# EAGLE design TIVA_SHIELD_Ver_1.4 (EAGLE 9.6.2)
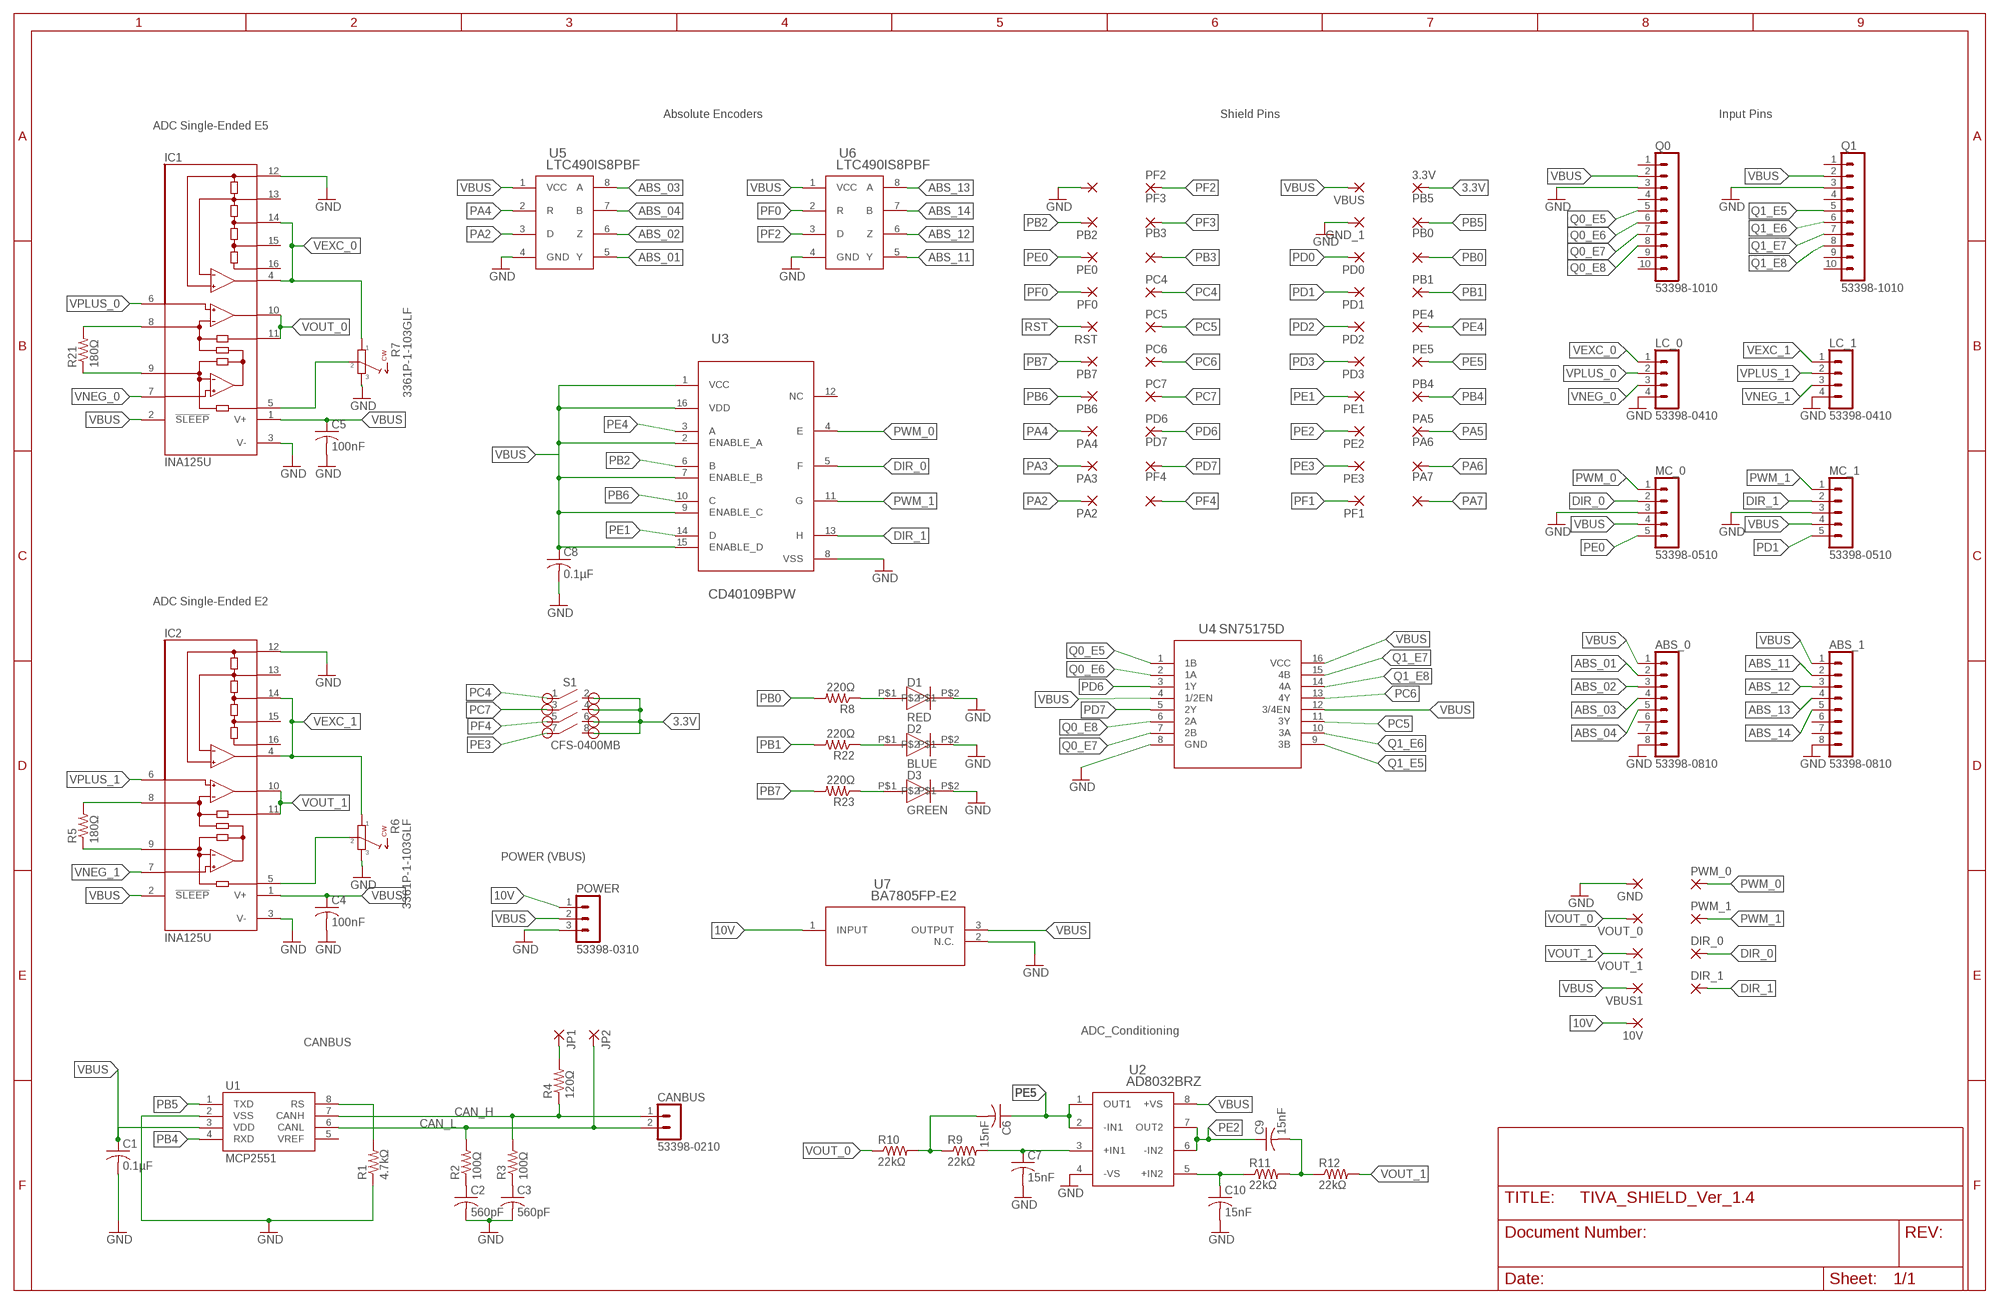
[diagram p0: schematic, sheet 1]

## Parts
3.3V  1,6/0,9  [1,6/0,9]
10V  SMD2  [SMD1,27-2,54]
ABS_0  53398-0810  [53398-0810]
ABS_1  53398-0810  [53398-0810]
C1  0.1µF  C-USC0805  [C0805]
C2  560pF  C-USC0805  [C0805]
C3  560pF  C-USC0805  [C0805]
C4  100nF  C-USC0805  [C0805]
C5  100nF  C-USC0805  [C0805]
C6  15nF  C-USC0805  [C0805]
C7  15nF  C-USC0805  [C0805]
C8  0.1µF  C-USC0805  [C0805]
C9  15nF  C-USC0805  [C0805]
C10  15nF  C-USC0805  [C0805]
CANBUS  53398-0210  [53398-0210]
D1  RED  CHANZON-1206-LED-DIODESMD  [CHANZON-1206-LED-DIODE]
D2  BLUE  CHANZON-1206-LED-DIODESMD  [CHANZON-1206-LED-DIODE]
D3  GREEN  CHANZON-1206-LED-DIODESMD  [CHANZON-1206-LED-DIODE]
DIR_0  SMD2  [SMD1,27-2,54]
DIR_1  SMD2  [SMD1,27-2,54]
GND  SMD2  [SMD1,27-2,54]
GND_0  1,6/0,9  [1,6/0,9]
GND_1  1,6/0,9  [1,6/0,9]
IC1  INA125U  [SO16-1]
IC2  INA125U  [SO16-1]
JP1  1,6/0,9  [1,6/0,9]
JP2  1,6/0,9  [1,6/0,9]
LC_0  53398-0410  [53398-0410]
LC_1  53398-0410  [53398-0410]
MC_0  53398-0510  [53398-0510]
MC_1  53398-0510  [53398-0510]
PA2  1,6/0,9  [1,6/0,9]
PA3  1,6/0,9  [1,6/0,9]
PA4  1,6/0,9  [1,6/0,9]
PA5  1,6/0,9  [1,6/0,9]
PA6  1,6/0,9  [1,6/0,9]
PA7  1,6/0,9  [1,6/0,9]
PB0  1,6/0,9  [1,6/0,9]
PB1  1,6/0,9  [1,6/0,9]
PB2  1,6/0,9  [1,6/0,9]
PB3  1,6/0,9  [1,6/0,9]
PB4  1,6/0,9  [1,6/0,9]
PB5  1,6/0,9  [1,6/0,9]
PB6  1,6/0,9  [1,6/0,9]
PB7  1,6/0,9  [1,6/0,9]
PC4  1,6/0,9  [1,6/0,9]
PC5  1,6/0,9  [1,6/0,9]
PC6  1,6/0,9  [1,6/0,9]
PC7  1,6/0,9  [1,6/0,9]
PD0  1,6/0,9  [1,6/0,9]
PD1  1,6/0,9  [1,6/0,9]
PD2  1,6/0,9  [1,6/0,9]
PD3  1,6/0,9  [1,6/0,9]
PD6  1,6/0,9  [1,6/0,9]
PD7  1,6/0,9  [1,6/0,9]
PE0  1,6/0,9  [1,6/0,9]
PE1  1,6/0,9  [1,6/0,9]
PE2  1,6/0,9  [1,6/0,9]
PE3  1,6/0,9  [1,6/0,9]
PE4  1,6/0,9  [1,6/0,9]
PE5  1,6/0,9  [1,6/0,9]
PF0  1,6/0,9  [1,6/0,9]
PF1  1,6/0,9  [1,6/0,9]
PF2  1,6/0,9  [1,6/0,9]
PF3  1,6/0,9  [1,6/0,9]
PF4  1,6/0,9  [1,6/0,9]
POWER  53398-0310  [53398-0310]
PWM_0  SMD2  [SMD1,27-2,54]
PWM_1  SMD2  [SMD1,27-2,54]
Q0  53398-1010  [53398-1010]
Q1  53398-1010  [53398-1010]
R1  4.7kΩ  R-US_R0805  [R0805]
R2  100Ω  R-US_R0805  [R0805]
R3  100Ω  R-US_R0805  [R0805]
R4  120Ω  R-US_R0805  [R0805]
R5  180Ω  R-US_R0805  [R0805]
R6  3361P-1-103GLF  3361P-1-103GLFSMD  [3361P-1-103GLF]
R7  3361P-1-103GLF  3361P-1-103GLFSMD  [3361P-1-103GLF]
R8  220Ω  R-US_R0805  [R0805]
R9  22kΩ  R-US_R0805  [R0805]
R10  22kΩ  R-US_R0805  [R0805]
R11  22kΩ  R-US_R0805  [R0805]
R12  22kΩ  R-US_R0805  [R0805]
R21  180Ω  R-US_R0805  [R0805]
R22  220Ω  R-US_R0805  [R0805]
R23  220Ω  R-US_R0805  [R0805]
RST  1,6/0,9  [1,6/0,9]
S1  CFS-0400MB  CFS-0400MBSMD  [CFS-0400MB]
U1  MCP2551  [SO08]
U2  AD8032BRZ  [R_8_ADI]
U3  CD40109BPW  [PW0016A_N]
U4  SN75175D  [D16]
U5  LTC490IS8PBF  [SO-8_S]
U6  LTC490IS8PBF  [SO-8_S]
U7  BA7805FP-E2  [TO252-3_ROM]
VBUS  1,6/0,9  [1,6/0,9]
VBUS1  SMD2  [SMD1,27-2,54]
VOUT_0  SMD2  [SMD1,27-2,54]
VOUT_1  SMD2  [SMD1,27-2,54]

## Nets
3.3V: 3.3V.1(P) S1.2 S1.4 S1.6 S1.8
10V: 10V.1(P) POWER.1 U7.1(INPUT)
ABS_01: ABS_0.2 U5.5(Y)
ABS_02: ABS_0.3 U5.6(Z)
ABS_03: ABS_0.4 U5.8(A)
ABS_04: ABS_0.5 U5.7(B)
ABS_11: ABS_1.2 U6.5(Y)
ABS_12: ABS_1.3 U6.6(Z)
ABS_13: ABS_1.4 U6.8(A)
ABS_14: ABS_1.5 U6.7(B)
CAN_H: CANBUS.1 R3.2 R4.1 U1.7(CANH)
CAN_L: CANBUS.2 JP2.1(P) R2.2 U1.6(CANL)
DIR_0: DIR_0.1(P) MC_0.2 U3.5(F)
DIR_1: DIR_1.1(P) MC_1.2 U3.13(H)
GND: ABS_0.8 ABS_1.8 C1.2 C2.2 C3.2 C4.2 C5.2 C7.2 C8.2 C10.2 D1.P$2 D2.P$2 D3.P$2 GND.1(P) GND_0.1(P) GND_1.1(P) IC1.3(V-) IC1.12(REFCOM) IC2.3(V-) IC2.12(REFCOM) LC_0.4 LC_1.4 MC_0.3 MC_1.3 POWER.3 Q0.3 Q1.3 R1.1 R6.3 R7.3 U1.2(VSS) U2.4(-VS) U3.8(VSS) U4.8(GND) U5.4(GND) U6.4(GND) U7.2(N.C.)
N$1: R1.2 U1.8(RS)
N$2: D1.P$1 R8.1
N$3: D2.P$1 R22.1
N$4: C2.1 R2.1
N$5: C3.1 R3.1
N$6: JP1.1(P) R4.2
N$7: IC2.9(RG) R5.1
N$8: IC2.8(RG) R5.2
N$9: IC2.5(REF) R6.2
N$10: IC1.9(RG) R21.1
N$11: IC1.8(RG) R21.2
N$12: IC1.5(REF) R7.2
N$13: C10.1 R11.1 U2.5(+IN2)
N$14: C9.2 R11.2 R12.1
N$15: C7.1 R9.2 U2.3(+IN1)
N$18: C6.2 R9.1 R10.2
N$21: D3.P$1 R23.1
PA2: PA2.1(P) U5.3(D)
PA3: PA3.1(P)
PA4: PA4.1(P) U5.2(R)
PA5: PA5.1(P)
PA6: PA6.1(P)
PA7: PA7.1(P)
PB0: PB0.1(P) R8.2
PB1: PB1.1(P) R22.2
PB2: PB2.1(P) U3.6(B)
PB3: PB3.1(P)
PB4: PB4.1(P) U1.4(RXD)
PB5: PB5.1(P) U1.1(TXD)
PB6: PB6.1(P) U3.10(C)
PB7: PB7.1(P) R23.2
PC4: PC4.1(P) S1.1
PC5: PC5.1(P) U4.11(3Y)
PC6: PC6.1(P) U4.13(4Y)
PC7: PC7.1(P) S1.3
PD0: PD0.1(P)
PD1: MC_1.5 PD1.1(P)
PD2: PD2.1(P)
PD3: PD3.1(P)
PD6: PD6.1(P) U4.3(1Y)
PD7: PD7.1(P) U4.5(2Y)
PE0: MC_0.5 PE0.1(P)
PE1: PE1.1(P) U3.14(D)
PE2: C9.1 PE2.1(P) U2.6(-IN2) U2.7(OUT2)
PE3: PE3.1(P) S1.7
PE4: PE4.1(P) U3.3(A)
PE5: C6.1 PE5.1(P) U2.1(OUT1) U2.2(-IN1)
PF0: PF0.1(P) U6.2(R)
PF1: PF1.1(P)
PF2: PF2.1(P) U6.3(D)
PF3: PF3.1(P)
PF4: PF4.1(P) S1.5
PWM_0: MC_0.1 PWM_0.1(P) U3.4(E)
PWM_1: MC_1.1 PWM_1.1(P) U3.11(G)
Q0_E5: Q0.5 U4.1(1B)
Q0_E6: Q0.6 U4.2(1A)
Q0_E7: Q0.7 U4.7(2B)
Q0_E8: Q0.8 U4.6(2A)
Q1_E5: Q1.5 U4.9(3B)
Q1_E6: Q1.6 U4.10(3A)
Q1_E7: Q1.7 U4.15(4B)
Q1_E8: Q1.8 U4.14(4A)
RST: RST.1(P)
VBUS: ABS_0.1 ABS_1.1 C1.1 C4.1 C5.1 C8.1 IC1.1(V+) IC1.2(!SLEEP) IC2.1(V+) IC2.2(!SLEEP) MC_0.4 MC_1.4 POWER.2 Q0.2 Q1.2 U1.3(VDD) U2.8(+VS) U3.1(VCC) U3.2(ENABLE_A) U3.7(ENABLE_B) U3.9(ENABLE_C) U3.15(ENABLE_D) U3.16(VDD) U4.4(1/2EN) U4.12(3/4EN) U4.16(VCC) U5.1(VCC) U6.1(VCC) U7.3(OUTPUT) VBUS1.1(P) VBUS.1(P)
VEXC_0: IC1.4(REFOUT) IC1.14(REF2.5) LC_0.1 R7.1
VEXC_1: IC2.4(REFOUT) IC2.14(REF2.5) LC_1.1 R6.1
VNEG_0: IC1.7(-IN) LC_0.3
VNEG_1: IC2.7(-IN) LC_1.3
VOUT_0: IC1.10(OUT) IC1.11(SENSE) R10.1 VOUT_0.1(P)
VOUT_1: IC2.10(OUT) IC2.11(SENSE) R12.2 VOUT_1.1(P)
VPLUS_0: IC1.6(+IN) LC_0.2
VPLUS_1: IC2.6(+IN) LC_1.2
Unconnected: ABS_0.6 ABS_0.7 ABS_1.6 ABS_1.7 IC1.13(REFBG) IC1.15(REF5) IC1.16(REF10) IC2.13(REFBG) IC2.15(REF5) IC2.16(REF10) Q0.1 Q0.4 Q0.9 Q0.10 Q1.1 Q1.4 Q1.9 Q1.10 U1.5(VREF) U3.12(NC)

## Notes on the sheet
- Absolute Encoders | Shield Pins | Input Pins
- ADC Single-Ended E5
- ADC Single-Ended E2
- POWER (VBUS)
- ADC_Conditioning
- CANBUS

## Library data of the parts
3.3V GND_0 GND_1 JP1 JP2 PA2-PA7 PB0 PB1-PB7 PC4-PC7 PD0 PD1-PD3 PD6 PD7 PE0 PE1-PE5 PF0 PF1-PF4 RST VBUS = wirepad:1,6/0,9: THROUGH-HOLE PAD
10V DIR_0 DIR_1 GND PWM_0 PWM_1 VBUS1 VOUT_0 VOUT_1 = wirepad:SMD2: SMD PAD
ABS_0 ABS_1 = con-molex-picoblade:53398-0810: HEADER
C1-C10 = rcl:C-US: CAPACITOR, American symbol; SPICEPREFIX: C
CANBUS = con-molex-picoblade:53398-0210: HEADER
D1-D3 = TREC_Library:CHANZON-1206-LED-DIODE: CHANZON LED SMD LED - DIODE AMAZON (SPECS) <https://www.amazon.com/Assorted-Lighting-Electronics-Components-Emitting/dp/B01CUGAFEC/?_encoding=UTF8&pd_rd_w=PdHhr&pf_rd_p=067e8e18-34c5-4e6e-8c6c-a4d937ff3226&pf_rd_r=9ZYCMCQ7Q8WSDYGBMR1N&pd_rd_r=b2ea11af-44db-4efc-a7a6-b5af0fc9b5f0&pd_rd_wg=P0i95&ref_=pd_gw_ci_mcx_mi&th=1>; VALUE: CHANZON-LED
IC1 IC2 = burr-brown_1:INA125: Instrumentation Amplifier with Precision Voltage Reference; MF: TEXAS INSTRUMENT CONNECTORS; MPN: INA125U; OC_FARNELL: 1304375; OC_NEWARK: 80K5901
LC_0 LC_1 = con-molex-picoblade:53398-0410: HEADER
MC_0 MC_1 = con-molex-picoblade:53398-0510: HEADER
POWER = con-molex-picoblade:53398-0310: HEADER
Q0 Q1 = con-molex-picoblade:53398-1010: HEADER
R1-R5 R8-R12 R21-R23 = rcl:R-US_: RESISTOR, American symbol; SPICEPREFIX: R
R6 R7 = TREC_Library:3361P-1-103GLF: Bourns Surface Mount Trimmer Potentiometer
S1 = TREC_Library:CFS-0400MB: CFS Slide Switches 4 Position Slide Switch (Under Dip Switches) CFS-0400MB CFS = Series Name 04 = Number of bits 00 = Flat Knob washable type M = Packing = Magzine B = Gull Wing A bit is a position, example, 4 bits is 4 switches CFS DATASHEET <https://www.nidec-copal-electronics.com/e/catalog/switch/cfs.pdf>
U1 = SparkFun-IC-Comms:MCP2551: MCP2551 High Speed CAN Transceiver High speed CAN transceiver Datasheet <http://www.sparkfun.com/datasheets/DevTools/Arduino/MCP2551.pdf> SparkFun Products CAN-BUS Shield <https://www.sparkfun.com/products/13262> (DEV-13262) SparkFun OBD-II UART <https://www.sparkfun.com/products/9555> (WIG-09555); PROD_ID: IC-09907
U2 = AD8032BRZ:AD8032BRZ; COPYRIGHT: Copyright (C) 2021 Ultra Librarian. All rights reserved.; MANUFACTURER_PART_NUMBER: AD8032BRZ; MFR_NAME: Analog Devices Inc
U3 = TREC_Library:CD40109BPW; COPYRIGHT: Copyright (C) 2022 Ultra Librarian. All rights reserved.; MANUFACTURER_PART_NUMBER: CD40109BPW; MFR_NAME: Texas Instruments; REFDES: RefDes; TYPE: TYPE
U4 = TREC_Library:SN75175D; COPYRIGHT: Copyright (C) 2022 Ultra Librarian. All rights reserved.; MANUFACTURER_PART_NUMBER: SN75175D; MFR_NAME: Texas Instruments
U5 U6 = LTC490:LTC490IS8PBF; MANUFACTURER_PART_NUMBER: LTC490IS8#PBF; VENDOR: Linear Technology
U7 = Rohm_Semiconductors:BA7805FP-E2; COPYRIGHT: Copyright (C) 2021 Ultra Librarian. All rights reserved.; MANUFACTURER_PART_NUMBER: BA7805FP-E2; MFR_NAME: ROHM Semiconductor

## Board
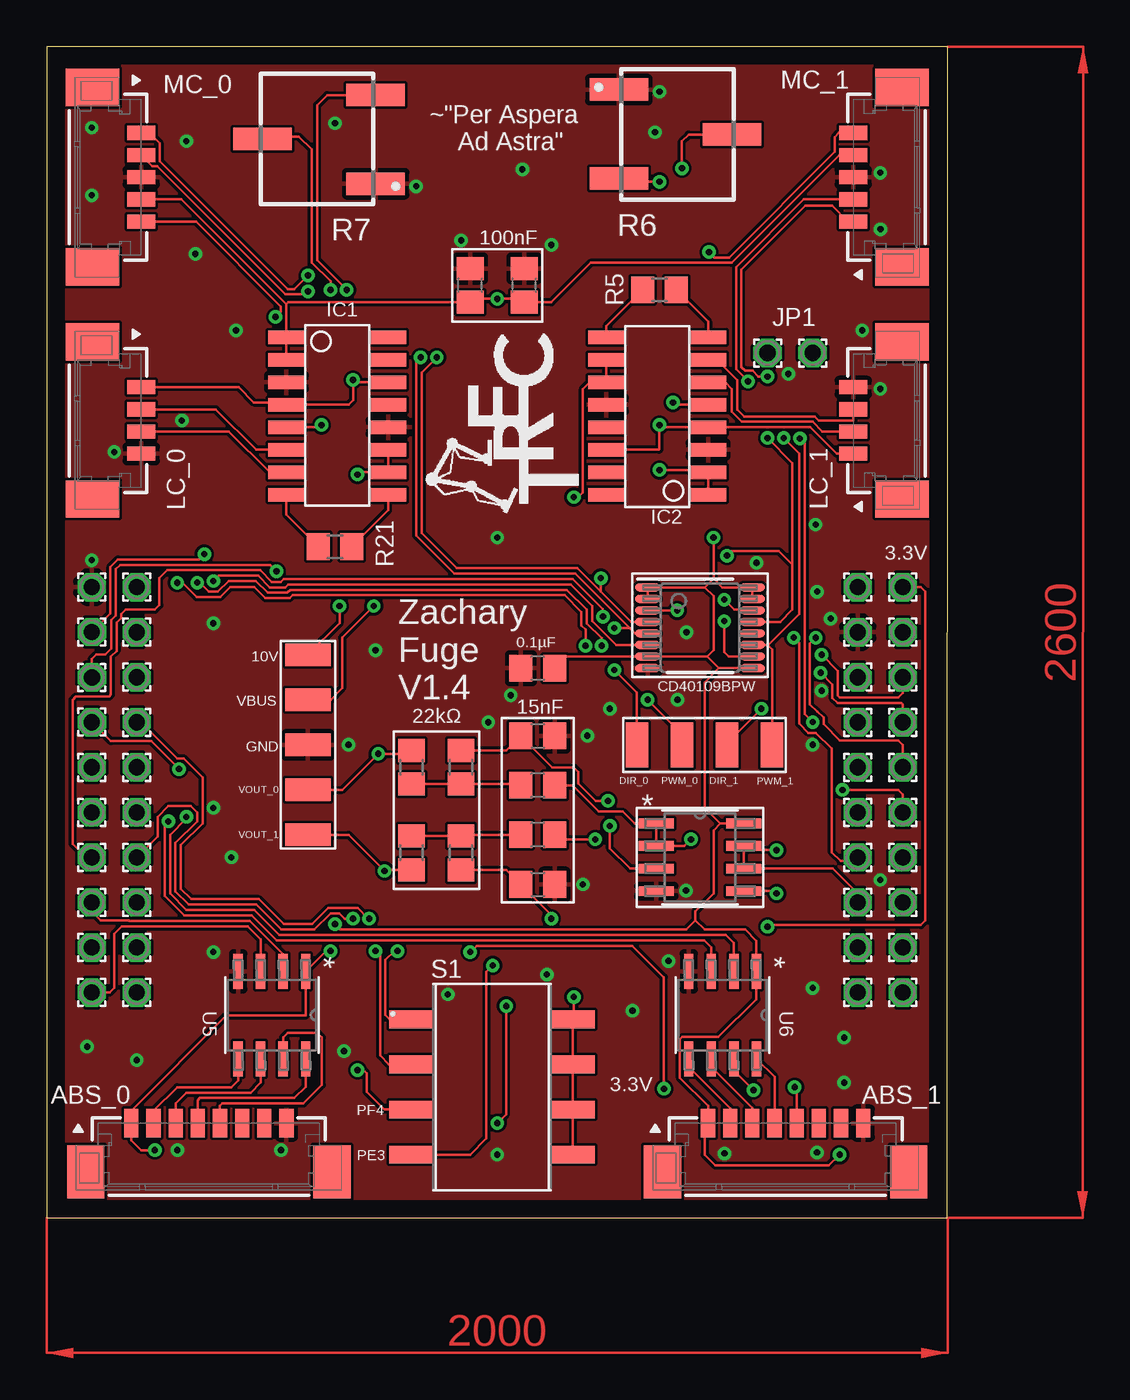
[diagram p1: board, top side]
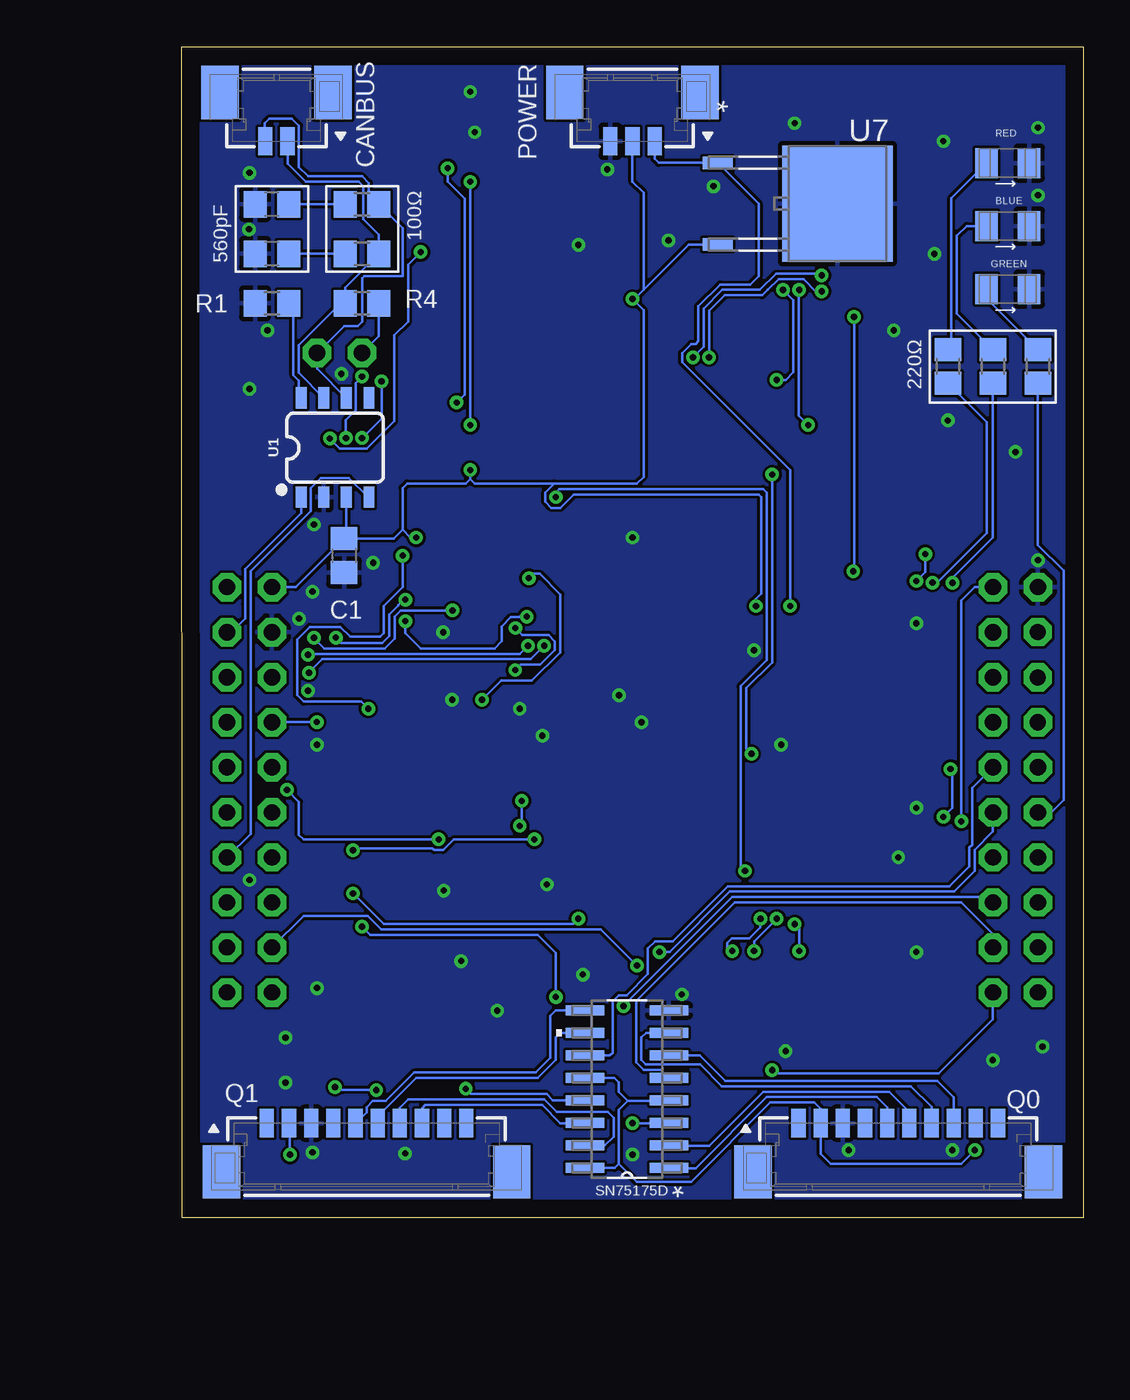
[diagram p2: board, bottom side, seen from below]

Size 50.81 x 66.04 mm. Coordinates in mm from the lower left corner, seen from the top.
Outline: 0,0 50.78,0 50.8,66.04 0,66.04 0,0
Copper layers (1*16): Top 0.035mm / dielectric 1.5mm / Bottom 0.035mm
Design rules "default": minimum track width 6mil, minimum drill 0.35mm, track to track 6mil, track to pad 6mil, pad to pad 6mil, via to via 6mil, smd to smd 6mil, copper to edge 40mil, drill to drill 6mil, minimum pad ring 10mil, minimum via ring 8mil, stop-mask expansion 4mil, vias tented up to drill 0mil, thermal gap 10mil

### Footprints (pad centres in the part's own frame; a part is rotated, then mirrored left to right if it is on the bottom)
1,6/0,9 = drill 0.914 pad 1.6 octagon: 1 0,0
SMD1,27-2,54 = smd 1.27 x 2.54: 1 0,0
53398-0810 = smd 0.8 x 1.6: 1 4.375,0; 2 3.125,0; 3 1.875,0; 4 0.625,0; 5 -0.625,0; 6 -1.875,0; 7 -3.125,0; 8 -4.375,0 | smd 2.1 x 3: M1 6.935,2.75; M2 -6.935,2.75
C0805 = smd 1.3 x 1.5: 1 -0.95,0; 2 0.95,0
53398-0210 = smd 0.8 x 1.6: 1 0.625,0; 2 -0.625,0 | smd 2.1 x 3: M1 3.185,2.75; M2 -3.185,2.75
CHANZON-1206-LED-DIODE = smd 1.27 x 1.7: P$1 0.4,0.8; P$2 2.8,0.8
SO16-1 = smd 0.762 x 2.032: 1 -4.445,-4.775; 2 -3.175,-4.775; 3 -1.905,-4.775; 4 -0.635,-4.775; 5 0.635,-4.775; 6 1.905,-4.775; 7 3.175,-4.775; 8 4.445,-4.775; 9 4.445,0.965; 10 3.175,0.965; 11 1.905,0.965; 12 0.635,0.965; 13 -0.635,0.965; 14 -1.905,0.965; 15 -3.175,0.965; 16 -4.445,0.965
53398-0410 = smd 0.8 x 1.6: 1 1.875,0; 2 0.625,0; 3 -0.625,0; 4 -1.875,0 | smd 2.1 x 3: M1 4.435,2.75; M2 -4.435,2.75
53398-0510 = smd 0.8 x 1.6: 1 2.5,0; 2 1.25,0; 3 0,0; 4 -1.25,0; 5 -2.5,0 | smd 2.1 x 3: M1 5.06,2.75; M2 -5.06,2.75
53398-0310 = smd 0.8 x 1.6: 1 1.25,0; 2 0,0; 3 -1.25,0 | smd 2.1 x 3: M1 3.81,2.75; M2 -3.81,2.75
53398-1010 = smd 0.8 x 1.6: 1 5.625,0; 2 4.375,0; 3 3.125,0; 4 1.875,0; 5 0.625,0; 6 -0.625,0; 7 -1.875,0; 8 -3.125,0; 9 -4.375,0; 10 -5.625,0 | smd 2.1 x 3: M1 8.185,2.75; M2 -8.185,2.75
R0805 = smd 1.3 x 1.5: 1 -0.95,0; 2 0.95,0
3361P-1-103GLF = smd 1.27 x 3.302: 1 2.353,-3.294; 2 -0.116,3.076; 3 -2.66,-3.301
CFS-0400MB = smd 1 x 2.5: 1 0.5,1.25; 2 0.5,10.35; 3 3.04,1.25; 4 3.04,10.35; 5 5.58,1.25; 6 5.58,10.35; 7 8.12,1.25; 8 8.12,10.35
SO08 = smd 0.6 x 1.2: 1 -1.905,-2.8; 2 -0.635,-2.8; 3 0.635,-2.8; 4 1.905,-2.8; 5 1.905,2.8; 6 0.635,2.8; 7 -0.635,2.8; 8 -1.905,2.8
R_8_ADI = smd 1.981 x 0.559: 1 -2.464,1.905; 2 -2.464,0.635; 3 -2.464,-0.635; 4 -2.464,-1.905; 5 2.464,-1.905; 6 2.464,-0.635; 7 2.464,0.635; 8 2.464,1.905
PW0016A_N = smd 1.4 x 0.45: 1 -2.95,2.275; 2 -2.95,1.625; 3 -2.95,0.975; 4 -2.95,0.325; 5 -2.95,-0.325; 6 -2.95,-0.975; 7 -2.95,-1.625; 8 -2.95,-2.275; 9 2.95,-2.275; 10 2.95,-1.625; 11 2.95,-0.975; 12 2.95,-0.325; 13 2.95,0.325; 14 2.95,0.975; 15 2.95,1.625; 16 2.95,2.275
D16 = smd 2.184 x 0.559: 1 -2.362,4.445; 2 -2.362,3.175; 3 -2.362,1.905; 4 -2.362,0.635; 5 -2.362,-0.635; 6 -2.362,-1.905; 7 -2.362,-3.175; 8 -2.362,-4.445; 9 2.362,-4.445; 10 2.362,-3.175; 11 2.362,-1.905; 12 2.362,-0.635; 13 2.362,0.635; 14 2.362,1.905; 15 2.362,3.175; 16 2.362,4.445
SO-8_S = smd 1.981 x 0.533: 1 -2.464,1.905; 2 -2.464,0.635; 3 -2.464,-0.635; 4 -2.464,-1.905; 5 2.464,-1.905; 6 2.464,-0.635; 7 2.464,0.635; 8 2.464,1.905
TO252-3_ROM = smd 0.711 x 1.702: 1 -2.3,-6.756; 3 2.3,-6.756 | smd 6.553 x 6.223: 2 0,0

### Placement (x,y rotation side)
3.3V  48.26,35.56 0 top
10V  14.73,31.75 90 top
ABS_0  9.14,5.33 180 top
ABS_1  41.66,5.33 180 top
C1  41.66,37.34 270 bottom
C2  45.72,57.15 180 bottom
C3  45.72,54.36 180 bottom
C4  26.92,52.58 90 top
C5  23.88,52.58 90 top
C6  27.69,24.38 180 top
C7  27.69,27.18 0 top
C8  27.69,30.99 180 top
C9  27.69,21.59 180 top
C10  27.69,18.8 0 top
CANBUS  45.47,60.71 0 bottom
D1  5.84,58.67 0 bottom
D2  5.84,55.12 0 bottom
D3  5.84,51.56 0 bottom
DIR_0  33.27,26.67 0 top
DIR_1  38.35,26.67 0 top
GND  14.73,26.67 270 top
GND_0  2.54,35.56 0 top
GND_1  45.72,33.02 0 top
IC1  18.29,45.21 270 top
IC2  32.51,45.21 90 top
JP1  40.64,48.77 90 top
JP2  43.18,48.77 90 top
LC_0  5.33,44.96 90 top
LC_1  45.47,44.96 270 top
MC_0  5.33,58.67 90 top
MC_1  45.47,58.67 270 top
PA2  2.54,12.7 0 top
PA3  2.54,15.24 0 top
PA4  2.54,17.78 0 top
PA5  48.26,17.78 0 top
PA6  48.26,15.24 0 top
PA7  48.26,12.7 0 top
PB0  48.26,30.48 0 top
PB1  48.26,27.94 0 top
PB2  2.55,33.03 0 top
PB3  5.08,30.48 0 top
PB4  48.26,20.32 0 top
PB5  48.26,33.02 0 top
PB6  2.54,20.32 0 top
PB7  2.54,22.86 0 top
PC4  5.08,27.94 0 top
PC5  5.08,25.4 0 top
PC6  5.08,22.86 0 top
PC7  5.08,20.32 0 top
PD0  45.72,30.48 0 top
PD1  45.72,27.94 0 top
PD2  45.72,25.4 0 top
PD3  45.72,22.86 0 top
PD6  5.08,17.78 0 top
PD7  5.08,15.24 0 top
PE0  2.55,30.47 0 top
PE1  45.72,20.32 0 top
PE2  45.72,17.78 0 top
PE3  45.72,15.24 0 top
PE4  48.26,25.4 0 top
PE5  48.26,22.86 0 top
PF0  2.55,27.95 0 top
PF1  45.72,12.7 0 top
PF2  5.08,35.56 0 top
PF3  5.08,33.02 0 top
PF4  5.08,12.7 0 top
POWER  25.4,60.71 0 bottom
PWM_0  35.81,26.67 0 top
PWM_1  40.89,26.67 180 top
Q0  10.41,5.33 180 bottom
Q1  40.39,5.33 180 bottom
R1  45.72,51.56 0 bottom
R2  40.64,57.15 0 bottom
R3  40.64,54.36 0 bottom
R4  40.64,51.56 0 bottom
R5  34.54,52.32 0 top
R6  35.56,60.96 270 top
R7  15.24,60.96 90 top
R8  7.62,48.01 270 bottom
R9  23.37,25.4 90 top
R10  20.57,25.4 270 top
R11  23.37,20.57 90 top
R12  20.57,20.57 270 top
R21  16.26,37.85 180 top
R22  5.08,48.01 270 bottom
R23  2.54,48.01 270 bottom
RST  2.54,25.4 0 top
S1  19.3,11.68 270 top
U1  42.16,43.43 0 bottom
U2  36.83,20.32 0 top
U3  36.83,33.27 0 top
U4  25.7,7.25 180 bottom
U5  12.7,11.43 270 top
U6  38.1,11.43 270 top
U7  13.84,57.19 270 bottom
VBUS  45.72,35.56 0 top
VBUS1  14.73,29.21 90 top
VOUT_0  14.73,24.13 90 top
VOUT_1  14.73,21.59 90 top

### Tracks (layer width: path | path; a pad name or v marks a point on that pad's centre or on a via)
3.3V  (via drill 0.35)
  Top 0.152: 3.3V.1 49.28,35.56 49.53,35.31 49.53,16.76 49.28,16.51 40.74,16.51 v40.64,16.41 | v29.72,12.45 29.72,11.25 S1.2 S1.4 S1.6 S1.8
  Bottom 0.152: v40.64,16.41 40.18,15.95 30.73,15.95 29.72,14.94 v29.72,12.45
10V  (via drill 0.35)
  Top 0.152: v16.51,34.5 16.51,33.53 10V.1
  Bottom 0.152: POWER.1 24.15,59.71 23.93,59.49 U7.1 18.29,57.18 18.29,53.09 18.75,52.63 20.46,52.63 21.69,51.4 21.69,49.43 21.84,49.28 22.09,49.28 22.6,48.77 22.6,48.26 16.51,42.17 v16.51,34.5
ABS_01
  Top 0.152: ABS_0.2 6.02,6.02 7.36,7.36 10.41,7.36 10.8,7.74 U5.5
ABS_02
  Top 0.152: ABS_0.3 7.27,6.45 7.87,7.05 11.5,7.05 12.06,7.62 U5.6
ABS_03
  Top 0.152: ABS_0.4 8.52,6.63 8.64,6.75 13.97,6.75 14.61,7.38 U5.8
ABS_04
  Top 0.152: ABS_0.5 9.77,6.31 9.91,6.44 14.48,6.44 15.52,7.49 15.52,10.16 15.27,10.41 13.59,10.41 13.34,10.16 U5.7
ABS_11
  Top 0.152: ABS_1.2 38.53,6.17 36.2,8.51 U6.5
ABS_12
  Top 0.152: ABS_1.3 39.78,6.19 37.47,8.51 U6.6
ABS_13
  Top 0.152: ABS_1.4 41.03,7.94 U6.8
ABS_14  (via drill 0.35)
  Top 0.152: U6.7 38.75,8.95 38.75,8.3 v39.84,7.2 | v42.16,7.37 42.28,7.25 ABS_1.5
  Bottom 0.152: v39.84,7.2 41.74,7.2 41.91,7.37 v42.16,7.37
CAN_H
  Bottom 0.152: U1.7 44.21,47.64 44.21,49.19 41.84,51.56 R4.1 41.59,52.46 R3.2 39.69,55.43 40.57,56.3 40.57,58.17 40.82,58.42 43.81,58.42 44.84,59.45 CANBUS.1
CAN_L
  Bottom 0.152: CANBUS.2 46.12,60.73 46.12,61.72 45.86,61.98 44.59,61.98 44.2,61.58 44.2,59.23 43.69,58.73 40.64,58.73 40.26,58.35 40.26,57.72 R2.2 38.35,55.81 38.35,53.09 40.53,53.09 40.64,52.98 40.64,50.55 40.89,50.29 41.66,50.29 JP2.1 43.18,47.88 U1.6
DIR_0  (via drill 0.35)
  Top 0.152: v21.08,48.51 20.83,48.26 20.83,38.48 22.99,36.32 29.8,36.32 32.86,33.26 | v14.73,52.23 14.57,52.07 13.46,52.07 6.23,59.3 5.96,59.3 MC_0.2 | U3.5 33.17,32.95 32.93,33.19 32.86,33.26 | DIR_0.1 33.27,29.62 v32,30.89 | v32,33.26 32.86,33.26
  Bottom 0.152: v21.08,48.51 21.08,51.15 20.21,52.02 18.09,52.02 17.78,52.32 17.77,52.32 17.16,52.93 15.75,52.93 15.05,52.23 v14.73,52.23 | v32,30.89 31.7,31.19 30.58,31.19 29.77,32 29.77,32.51 30.13,32.86 31.61,32.86 v32,33.26
DIR_1  (via drill 0.35)
  Top 0.152: v40.64,43.97 42.04,42.57 42.04,36.83 | v39.54,47.17 38.86,47.84 38.86,53.59 42.69,57.42 MC_1.2 | 42.04,36.83 42.04,34.8 42.04,34.29 41.35,33.6 U3.13 | DIR_1.1 38.35,26.77 v40.29,28.7 | v38.35,37.34 38.61,37.59 41.28,37.59 42.04,36.83
  Bottom 0.152: v40.64,43.97 39.54,45.07 v39.54,47.17 | v40.29,28.7 40.7,29.11 43.94,29.11 44.3,29.47 44.3,32.62 43.59,33.32 41.87,33.32 41.31,32.77 39.62,32.77 39.41,32.98 39.41,34.5 38.35,35.56 v38.35,37.34
GND  (via drill 0.35)
  other vias: 43.43,3.68 9.4,14.99 13.21,3.81 10.41,20.32 9.4,23.11 9.4,33.53 17.02,26.67 2.54,37.08 43.43,35.31 44.2,33.78 28.45,54.86 23.37,55.12 26.82,59.11 20.83,58.17 34.54,63.5 46.99,58.93 46.99,46.74 10.67,50.04 3.81,43.18 35.05,14.48 30.48,27.18 30.23,18.8 47.01,55.74 45.97,50.04 43.35,39.09 38.21,3.63 7.37,3.81 43.69,29.72 43.18,26.67 41.81,47.59 31.75,28.7 46.99,19.05 7.62,44.96 44.96,7.62 28.19,13.72 22.61,12.6 16.76,9.4 5.08,8.89 2.29,9.65 25.4,38.35 36.04,18.45 8.38,54.36 25.4,3.56 7.87,60.71 2.54,61.47 2.54,57.66 26.16,29.46 35.56,29.21 33.02,11.68 44.96,10.16 36.07,33.02 40.01,36.94 24.89,27.94 16.26,61.72 34.29,61.21 43.18,12.95 18.54,32
  pour Top: -4.06,68.07 55.37,68.07 61.98,61.47 61.98,5.33 54.86,-1.78 -1.52,-1.78 -5.33,2.03 -5.33,66.8
  pour Bottom: -7.62,68.83 -7.62,2.03 0.51,-6.1 53.09,-6.1 66.29,7.11 66.29,60.71 53.34,73.66 -2.79,73.66
N$1
  Bottom 0.152: U1.8 44.2,46.36 44.2,47.2 44.51,47.52 44.51,51.31 R1.2
N$2
  Bottom 0.152: R8.1 7.42,49.16 7.42,57.5 D1.P$1
N$3
  Bottom 0.152: R22.1 7.11,50.99 7.11,55.37 6.57,55.92 D2.P$1
N$4
  Bottom 0.152: C2.1 R2.1
N$5
  Bottom 0.152: R3.1 C3.1
N$6
  Bottom 0.152: JP1.1 39.69,49.72 R4.2
N$7
  Top 0.152: R5.1 31.55,50.28 IC2.9
N$8
  Top 0.152: R5.2 37.29,50.53 IC2.8
N$9  (via drill 0.35)
  Top 0.152: IC2.5 35.43,45.85 v35.31,45.97 | v35.81,59.18 35.81,60.71 36.18,61.08 R6.2
  Bottom 0.152: v35.31,45.97 34.85,46.43 34.85,57.45 35.81,58.42 v35.81,59.18
N$10
  Top 0.152: R21.1 19.25,39.89 IC1.9
N$11
  Top 0.152: R21.2 13.51,39.64 IC1.8
N$12  (via drill 0.35)
  Top 0.152: IC1.5 15.37,44.58 v15.49,44.7 | v16,52.32 16,52.8 14.94,53.87 14.94,60.25 14.22,60.96 12.28,60.96 R7.2
  Bottom 0.152: v15.49,44.7 16.03,45.24 16.03,52.3 v16,52.32
N$13  (via drill 0.35)
  Top 0.152: U2.5 41.02,18.41 v41.15,18.29 | v28.45,16.86 28.45,17.08 C10.1 25.91,19.62 R11.1
  Bottom 0.152: v41.15,18.29 39.42,16.56 28.75,16.56 v28.45,16.86
N$14
  Top 0.152: C9.2 23.43,21.59 R11.2 R12.1
N$15  (via drill 0.35)
  Top 0.152: v31.64,23.51 30.96,23.51 29.97,24.5 29.97,25.15 29.72,25.4 28.51,25.4 C7.1 25.91,26.35 R9.2 | U2.3 32.89,19.68 31.75,20.83 v31.75,22.1
  Bottom 0.152: v31.75,22.1 31.64,22.21 v31.64,23.51
N$18
  Top 0.152: R10.2 R9.1 26.67,24.45 C6.2
N$21
  Bottom 0.152: R23.1 5.44,51.86 D3.P$1
PA2
  Top 0.152: U5.3 12.06,15.7 11.34,16.43 4.24,16.43 3.81,16 3.81,12.95 3.56,12.7 PA2.1
PA4
  Top 0.152: U5.2 13.34,14.86 11.44,16.75 4.65,16.75 4.64,16.76 3.05,16.76 2.54,17.27 PA4.1
PB0  (via drill 0.35)
  Top 0.152: v8.49,35.81 8.63,35.81 9.15,35.3 9.65,35.3 10.25,35.9 11.79,35.9 12.45,35.24 13.57,35.24 13.74,35.41 29.33,35.41 30.45,34.29 30.45,33.52 31.29,32.68 v31.29,32.26 | v43.69,31.75 44.6,30.84 44.6,29.44 44.71,29.33 48.01,29.33 48.26,29.59 PB0.1
  Bottom 0.152: R8.2 5.42,44.86 5.42,38.61 8.22,35.81 v8.49,35.81 | v31.29,32.26 31.74,31.8 43.64,31.8 v43.69,31.75
PB1  (via drill 0.35)
  Top 0.152: v7.36,35.81 7.63,35.81 8.45,34.99 9.78,34.99 10.34,35.56 11.7,35.56 12.32,34.94 13.7,34.94 13.87,35.1 29.2,35.1 30.14,34.16 30.14,33.4 30.38,33.16 v30.38,32.26 | PB1.1 48.26,28.96 48.18,29.04 48.17,29.03 44.58,29.03 44.3,29.31 44.3,30.07 v43.63,30.73
  Bottom 0.152: R22.2 5.08,38.35 7.36,36.07 v7.36,35.81 | v30.38,32.26 31.14,31.5 42.87,31.5 v43.63,30.73
PB2  (via drill 0.35)
  Top 0.152: U3.6 32.1,32.3 30.75,33.65 30.75,34.5 29.54,35.71 13.61,35.71 13.45,35.55 12.58,35.55 11.92,36.21 9.7,36.21 v9.4,35.91 | PB2.1 3.59,34.07 3.59,36.7 4.01,37.12 8.59,37.12 v8.89,37.42
  Bottom 0.152: v8.89,37.42 8.89,36.41 v9.4,35.91
PB4
  Bottom 0.152: U1.4 40.31,40.63 41.39,41.72 42.97,41.72 43.54,41.15 43.54,39.85 46.92,36.46 46.92,21.66 PB4.1
PB5
  Bottom 0.152: U1.1 44.07,39.75 47.23,36.59 47.23,34.58 47.23,33.78 47.99,33.02 PB5.1
PB6  (via drill 0.35)
  Top 0.152: PB6.1 2.22,20.32 1.46,21.08 1.46,29.21 1.64,29.39 3.52,29.39 3.62,29.49 3.62,31.64 3.95,31.97 3.95,33.57 4.2,33.82 4.2,34.04 4.46,34.29 6.1,34.29 6.35,34.54 6.35,36.07 6.79,36.51 12.04,36.51 12.7,35.85 13.21,35.85 13.37,36.02 29.67,36.02 31.36,34.33 v31.36,33.9 | v38.2,33.64 38.2,31.91 38.45,31.65 U3.10
  Bottom 0.152: v31.36,33.9 31.75,33.9 31.79,33.86 32.25,33.86 32.77,33.35 32.77,32.51 33.17,32.11 37.34,32.11 38.2,32.97 v38.2,33.64
PB7
  Bottom 0.152: R23.2 2.54,37.94 1.09,36.49 1.09,23.55 1.78,22.86 PB7.1
PC4  (via drill 0.35)
  Top 0.152: S1.1 19.35,11.18 19.1,11.43 19.1,14.53 19.61,15.04 v19.77,15.04 | v18.18,16.86 18.13,16.86 17.52,17.47 15.88,17.47 14.97,16.56 13.36,16.56 11.95,17.97 8.14,17.97 7.57,18.54 7.57,21.01 8.79,22.23 8.79,24.84 7.72,25.91 7.37,25.91 5.33,27.94 PC4.1
  Bottom 0.152: v19.77,15.04 19.87,15.04 20.07,15.24 20.07,15.49 19.81,15.75 18.82,15.75 18.18,16.39 v18.18,16.86
PC5
  Bottom 0.152: PC5.1 6.25,24.23 6.25,21.04 6.41,20.87 6.41,19.81 7.53,18.69 20.03,18.69 23.13,15.59 24.13,15.59 24.54,15.18 24.54,13.74 25.73,12.54 26.16,12.54 26.52,12.19 26.52,9.3 26.67,9.14 28.06,9.14 U4.11
PC6  (via drill 0.35)
  Top 0.152: v34.8,7.27 34.8,13.56 33.02,15.34 24.23,15.34 v23.88,14.99
  Bottom 0.152: U4.13 29.88,6.61 30.24,6.97 34.5,6.97 v34.8,7.27 | v23.88,14.99 23.31,14.99 19.9,18.39 7.26,18.39 6.11,19.55 6.11,20.75 5.08,21.77 PC6.1
PC7  (via drill 0.35)
  Top 0.152: S1.3 19.3,8.64 18.8,9.14 18.8,14.79 v18.54,15.04 | v17.27,16.86 16.81,16.86 16.51,17.16 16,17.16 15.09,16.26 13.23,16.26 11.82,17.67 8,17.67 7.26,18.4 7.26,21.14 8.48,22.36 8.48,22.86 8.12,23.21 6.86,23.21 6.25,22.6 6.25,21.49 PC7.1
  Bottom 0.152: v18.54,15.04 18.54,15.59 v17.27,16.86
PD1  (via drill 0.35)
  Top 0.152: MC_1.5 44.66,61.17 44.43,60.94 44.43,60.1 38.48,54.15 37.64,54.15 v37.34,54.45 | v43.19,27.95 42.72,28.41 42.72,43.68 v42.46,43.94
  Bottom 0.152: v37.34,54.45 38.05,53.74 38.05,50.55 38.83,49.77 38.83,44.92 40.39,43.36 41.91,43.36 42.46,43.91 v42.46,43.94 | v43.19,27.95 PD1.1
PD6  (via drill 0.35)
  Top 0.152: v25.4,5.33 25.91,5.84 v25.91,11.94
  Bottom 0.152: U4.3 v25.4,5.33 | v25.91,11.94 19.76,18.09 5.38,18.09 PD6.1
PD7
  Bottom 0.152: U4.5 23.79,8.33 24.76,8.33 25.2,8.76 25.2,11.45 | 25.2,11.45 | 25.2,11.45 25.2,12.22 19.64,17.78 6.86,17.78 5.08,16 PD7.1
PE0  (via drill 0.35)
  Top 0.152: MC_0.5 8.42,56.17 13.21,51.38 13.21,51.1 v12.91,50.8 | v12.95,36.46 12.6,36.82 4.14,36.82 3.9,36.58 3.9,33.95 3.64,33.69 3.64,32.09 3.3,31.75 2.79,31.75 2.54,31.5 2.54,30.48 PE0.1
  Bottom 0.152: v12.91,50.8 12.91,36.51 v12.95,36.46
PE1  (via drill 0.35)
  Top 0.152: PE1.1 45.51,20.11 44.75,20.11 44.26,20.61 44.26,26.45 43.37,27.34 42.94,27.34 42.42,27.86 42.42,32.41 v42.12,32.71 | v38.2,34.85 38.76,34.29 39.74,34.29 U3.14
  Bottom 0.152: v42.12,32.71 41.81,32.41 39.5,32.41 39.11,32.8 39.11,34.02 38.61,34.52 38.61,34.54 38.3,34.85 v38.2,34.85
PE2  (via drill 0.35)
  Top 0.152: v30.93,21.34 28.89,21.34 C9.1 | PE2.1 45.72,18.29 44.32,19.68 U2.6 U2.7 39.52,20.73 v41.15,20.73
  Bottom 0.152: v30.93,21.34 35.46,21.34 36.07,20.73 36.57,20.73 36.67,20.83 41.05,20.83 v41.15,20.73
PE3  (via drill 0.35)
  Top 0.152: v25.15,14.22 24.79,13.87 24.79,4.47 23.88,3.56 20.56,3.56 S1.7
  Bottom 0.152: PE3.1 43.94,17.02 40.31,17.02 39.55,16.26 27.18,16.26 v25.15,14.22
PE4  (via drill 0.35)
  Top 0.152: PE4.1 48.26,26.67 48.02,26.91 44.72,26.91 43.79,27.83 43.79,28.2 43.44,28.55 43.43,28.55 43.03,28.96 43.03,32.37 v43.35,32.7 | U3.3 v35.55,34.25 | v35.55,34.25
  Bottom 0.152: v35.55,34.25 38.45,34.25 38.81,33.89 38.81,32.67 39.37,32.11 42.76,32.11 v43.35,32.7
PE5  (via drill 0.35)
  Top 0.152: PE5.1 48.26,23.88 48.01,24.13 v44.87,24.13 | C6.1 29.65,24.38 31.13,22.9 32.47,22.9 33.15,22.23 U2.1 U2.2 35.94,20.95 v36.32,21.34
  Bottom 0.152: v44.87,24.13 44.2,23.46 44.2,21.59 43.94,21.34 v36.32,21.34
PF0  (via drill 0.35)
  Top 0.152: U6.2 38.73,15.49 38.28,15.95 13.11,15.95 11.7,17.36 7.87,17.36 6.96,18.28 6.96,21.59 7.87,22.51 v7.87,22.61 | PF0.1 3.62,26.87 5.89,26.87 v7.46,25.3
  Bottom 0.152: v7.87,22.61 7.37,23.11 7.37,25.2 v7.46,25.3
PF2  (via drill 0.35)
  Top 0.152: U6.3 37.47,15.24 37.06,15.65 12.98,15.65 11.57,17.06 7.75,17.06 6.65,18.15 6.65,22.15 v6.86,22.35
  Bottom 0.152: v6.86,22.35 6.86,34.8 6.1,35.56 PF2.1
PF4  (via drill 0.35)
  Top 0.152: S1.5 19.04,6.1 18.03,7.11 18.03,8.13 17.83,8.33 v17.53,8.33
  Bottom 0.152: v17.53,8.33 17.33,8.13 8.13,8.13 5.08,11.18 PF4.1
PWM_0  (via drill 0.35)
  Top 0.152: v21.99,48.51 21.13,47.66 21.13,38.61 23.11,36.63 27.18,36.63 | MC_0.1 5.8,61.17 6.37,60.6 6.37,59.59 13.59,52.38 13.97,52.38 v14.73,53.14 | 27.18,36.63 29.92,36.63 31.24,35.31 | U3.4 32.95,33.6 31.24,35.31 | PWM_0.1 35.81,27.28 v33.88,29.21 | v31.24,36.07 31.24,35.31 | 27.18,36.63
  Bottom 0.152: v21.99,48.51 21.39,49.12 21.39,51.27 20.34,52.32 18.21,52.32 17.3,53.24 14.82,53.24 v14.73,53.14 | v31.24,36.07 30.99,36.32 30.64,36.32 29.47,35.15 29.47,31.88 31.06,30.28 32.81,30.28 v33.88,29.21
PWM_1  (via drill 0.35)
  Top 0.152: v40.64,47.44 40.13,47.44 39.79,47.77 39.37,47.77 39.17,47.98 39.17,53.47 42.76,57.06 44.28,57.06 45.17,56.17 MC_1.1 | v41.55,43.97 42.42,43.1 42.42,34.04 40.68,32.3 40.64,32.3 | 40.64,32.3 U3.11 | PWM_1.1 40.89,32.05 40.64,32.3
  Bottom 0.152: v41.55,43.97 41.55,44.99 41,45.54 41,47.08 v40.64,47.44
Q0_E5
  Bottom 0.152: Q0.5 11.04,6.21 11.63,6.81 17.83,6.81 21.84,2.79 U4.1
Q0_E6
  Bottom 0.152: Q0.6 9.79,5.98 10.92,7.11 18.03,7.11 21.08,4.06 U4.2
Q0_E7
  Bottom 0.152: Q0.7 8.54,6.25 9.7,7.42 13.97,7.42 20.37,7.42 21.59,8.64 24.64,8.64 24.89,8.89 24.89,10.16 24.63,10.42 U4.7
Q0_E8
  Bottom 0.152: Q0.8 7.29,6.78 8.23,7.72 10.92,7.72 11.18,7.72 20.17,7.72 21.6,9.15 U4.6
Q1_E5
  Bottom 0.152: Q1.5 40.39,5.96 40.39,6.23 40.02,6.59 39.37,6.59 39.3,6.59 37.71,8.19 30.85,8.19 30.02,9.02 30.02,11.38 29.71,11.69 U4.9
Q1_E6
  Bottom 0.152: Q1.6 39.76,5.71 37.59,7.88 34.55,7.88 34.54,7.87 30.73,7.87 29.72,8.89 29.72,10.16 29.45,10.42 U4.10
Q1_E7
  Bottom 0.152: U4.15 26.97,4.07 26.47,4.57 26.47,5.64 26.79,5.96 29.66,5.96 30.37,6.67 38.04,6.67 38.51,6.19 Q1.7
Q1_E8
  Bottom 0.152: Q1.8 37.26,6.17 37.07,6.36 30.49,6.36 29.46,5.33 U4.14
VBUS  (via drill 0.35)
  Top 0.152: IC1.2 IC1.1 13.51,51.51 | IC2.1 IC2.2 37.16,42.16 v34.54,42.16 | 13.51,51.51 13.63,51.63 C5.1 24.06,51.82 v25.4,51.82 26.74,51.82 C4.1 28.45,51.63 30.67,53.85 38.61,53.85 44.68,59.92 MC_1.4 | MC_0.4 7.6,57.42 13.51,51.51 | v16,15.04 15.75,15.04 U5.1 14.61,11.42 14.59,11.4 10.13,11.4 4.77,6.04 ABS_0.1 4.77,4.38 5.33,3.81 v6.1,3.81 | v16.26,16.56 16.56,16.26 36.07,16.26 36.58,16.76 | 36.58,16.76 37.08,16.26 39.37,16.26 40.01,15.62 U6.1 40.01,12.32 37.87,10.19 35.83,10.19 35.7,10.05 35.7,7.88 37.28,6.3 ABS_1.1 37.08,5.14 37.08,3.56 37.69,2.95 44.1,2.95 v44.7,3.56 | 37.97,22.23 37.08,23.11 37.08,30.2 37.89,31 | 37.97,22.23 37.59,21.84 37.59,18.29 36.58,17.27 36.58,16.76 | 37.97,22.23 U2.8 | 37.59,36.05 v37.59,38.35 | U3.2 U3.1 37.09,35.55 | U3.15 U3.16 38.09,35.55 37.59,36.05 | 37.24,31.65 U3.7 29.3,31.65 C8.1 | 37.24,31.65 37.59,32 37.59,35.05 37.09,35.55 | 37.24,31.65 37.89,31 | U3.9 37.89,31 | 37.09,35.55 37.59,36.05 | VBUS1.1 16,29.21 16.66,29.87 16.66,32.72 v18.44,34.5
  Bottom 0.152: 29.81,41.4 34.29,41.4 34.54,41.66 | 29.81,41.4 25.15,41.4 24.77,41.77 24.77,51.19 v25.4,51.82 25.28,51.82 24.77,52.32 | C1.1 38.86,38.29 38.35,38.8 | U1.3 41.53,38.41 C1.1 | C1.1 44.38,35.56 VBUS.1 | v34.54,42.16 34.54,41.66 | v16,15.04 16,16.3 v16.26,16.56 | 34.54,41.66 34.8,41.4 38.1,41.4 38.35,41.15 38.35,38.8 | v6.1,3.81 6.86,3.05 14.22,3.05 14.79,3.61 Q0.2 14.79,6.15 15.14,6.5 17.63,6.5 22.1,2.03 25.15,2.03 26.16,3.05 | v44.7,3.56 44.7,5.28 Q1.2 | 24.77,52.32 24.77,57.8 25.4,58.42 POWER.2 | U7.3 22.21,54.89 24.77,52.32 | 38.35,38.8 37.91,38.35 v37.59,38.35 | U4.12 26.43,7.88 26.16,7.62 26.16,7.11 25.65,6.6 | 26.16,3.05 26.16,6.1 25.65,6.6 | 26.16,3.05 26.41,2.8 U4.16 | 25.65,6.6 U4.4 | 29.81,41.4 30.32,40.89 30.32,40.39 29.97,40.03 29.47,40.03 28.71,40.79 18.29,40.79 18.14,40.64 18.14,35.2 18.44,34.9 v18.44,34.5
VEXC_0  (via drill 0.35)
  Top 0.152: LC_0.1 10.82,46.83 11.68,45.97 13.39,45.97 IC1.4 17.02,45.85 17.27,46.1 v17.27,47.24 17.27,47.12 IC1.14 | v16.91,52.32 15.24,53.99 15.24,62.74 15.81,63.31 R7.1
  Bottom 0.152: v17.27,47.24 16.76,47.24 16.33,47.68 16.33,51.74 v16.91,52.32
VEXC_1  (via drill 0.35)
  Top 0.152: LC_1.1 44.55,43.08 43.05,44.58 IC2.4 34.67,44.58 v34.54,44.7 34.54,43.34 34.51,43.31 IC2.14 | v34.54,58.42 32.45,58.42 R6.1
  Bottom 0.152: v34.54,44.7 v34.54,58.42
VNEG_0
  Top 0.152: IC1.7 12.57,42.04 10.28,44.33 LC_0.3
VNEG_1
  Top 0.152: LC_1.3 45.47,44.96 43.53,44.96 43.31,45.19 39.32,45.19 38.93,45.57 38.93,47.23 37.77,48.39 IC2.7
VOUT_0  (via drill 0.35)
  Top 0.152: IC1.11 IC1.10 17.65,42.04 v17.53,41.91 | R10.1 20.39,26.16 v18.69,26.16 16.66,24.13 VOUT_0.1
  Bottom 0.152: v17.53,41.91 17.53,31.32 18.98,29.86 18.98,26.45 v18.69,26.16
VOUT_1  (via drill 0.35)
  Top 0.152: IC2.10 IC2.11 30.61,47.12 30.23,46.74 30.23,40.89 29.97,40.64 v29.72,40.64 | R12.2 19.12,19.62 v19.05,19.56 17.02,21.59 VOUT_1.1
  Bottom 0.152: v29.72,40.64 29.72,40.89 29.52,41.1 18.03,41.1 17.83,40.89 17.83,31.45 19.3,29.98 19.3,19.8 v19.05,19.56
VPLUS_0
  Top 0.152: IC1.6 11.81,43.31 9.54,45.58 LC_0.2
VPLUS_1
  Top 0.152: LC_1.2 43.73,44.33 43.18,44.88 39.19,44.88 38.63,45.45 38.63,46.74 38.25,47.12 IC2.6
(copper drawn outside any net)
  shapes: Top area x2

### Text on the board
tNames: ~"Per Aspera / Ad Astra" | 100nF | VBUS | Zachary / Fuge / V1.4 | 22kΩ | 15nF | 3.3V | PF4 | PE3
bNames: 100Ω | 560pF | 220Ω